# EasyEDA schematic LcsNodes-Building-Block-Dual-Power-Module-L6205.json
TITLE: Dual Power Module - L6205; REV: 1.0; Date: 2022-09-19; Sheet: 1/1; Drawn By: helmut-f; Company: Your Company
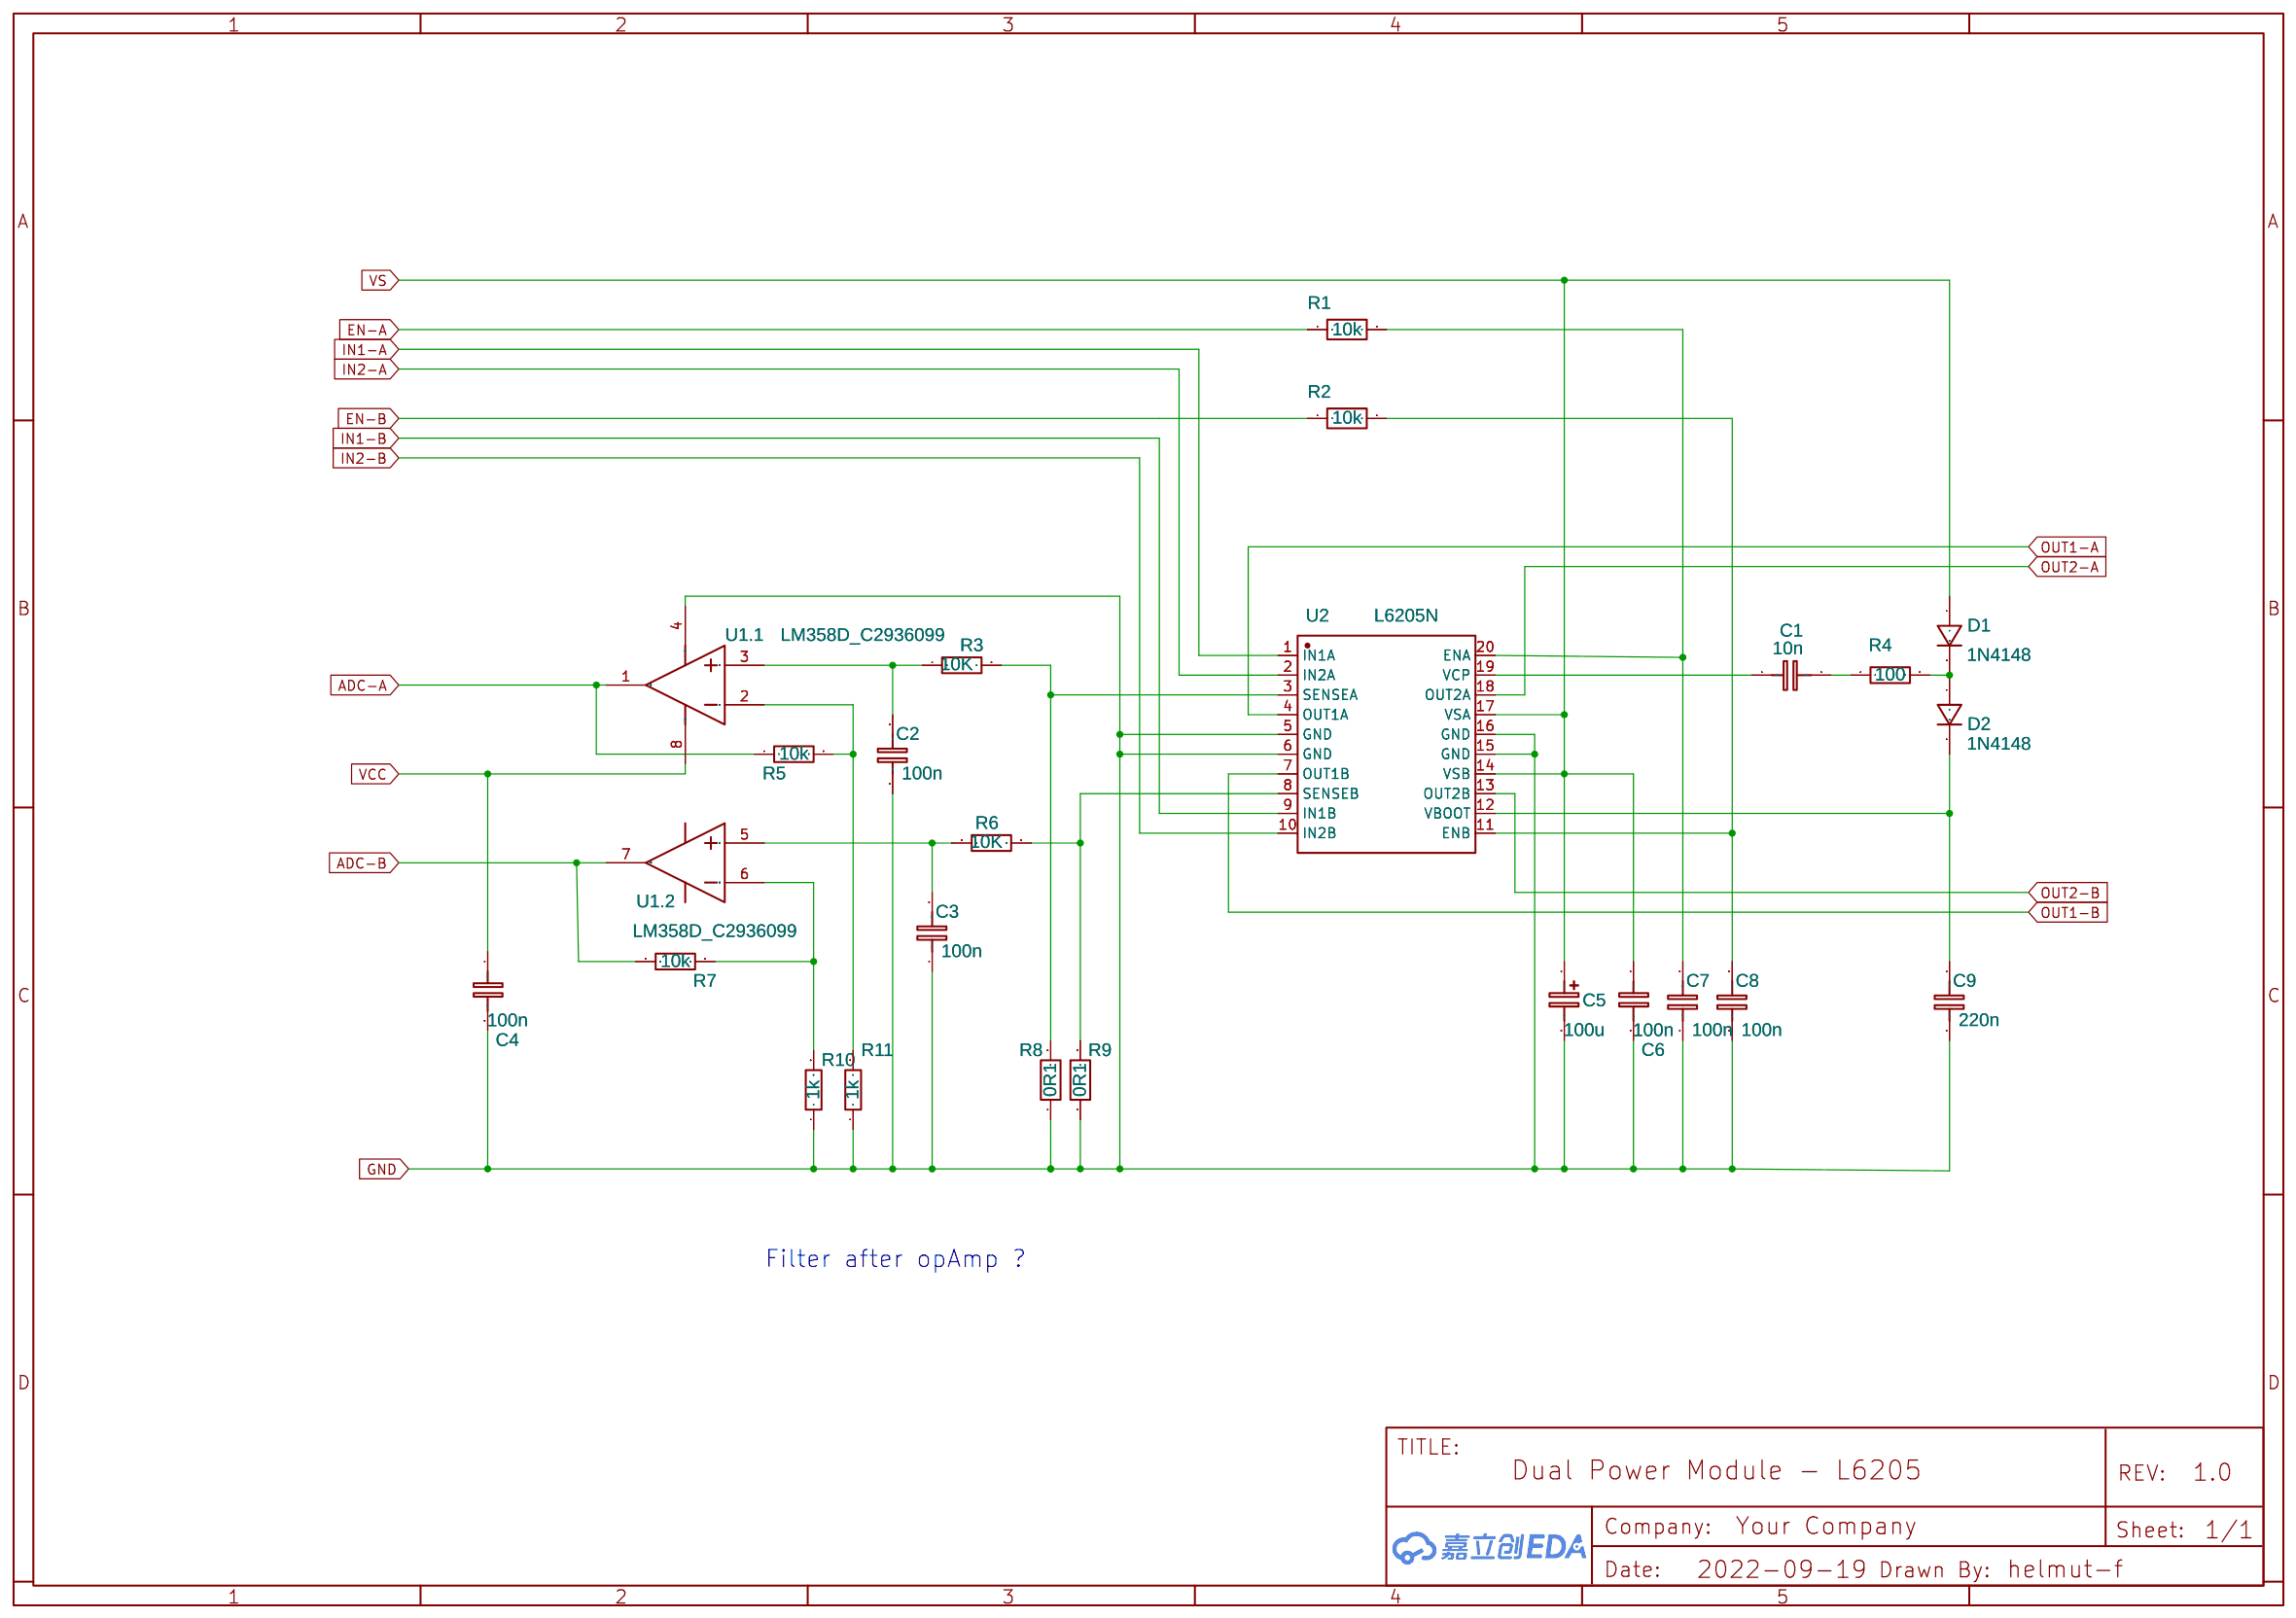
[diagram p0: schematic sheet]

## Parts
C1  10n  [RAD-0.2]
C2  100n  [RAD-0.2]
C3  100n  [RAD-0.2]
C4  100n  [RAD-0.2]
C5  100u  [CAP-D10.0×F5.0]
C6  100n  [RAD-0.2]
C7  100n  [RAD-0.2]
C8  100n  [RAD-0.2]
C9  220n  [RAD-0.2]
D1  1N4148  [DO-35_BD2.0-L4.0-P8.00-D0.5-FD]
D2  1N4148  [DO-35_BD2.0-L4.0-P8.00-D0.5-FD]
R1  10k  [R_AXIAL-0.3]
R2  10k  [R_AXIAL-0.3]
R3  10K  [AXIAL-0.1]
R4  100  [AXIAL-0.1]
R5  10k  [AXIAL-0.1]
R6  10K  [AXIAL-0.1]
R7  10k  [AXIAL-0.1]
R8  0R1  [R_AXIAL-0.5]
R9  0R1  [R_AXIAL-0.5]
R10  1k  [AXIAL-0.1]
R11  1k  [AXIAL-0.1]
U1  LM358D_C2936099  [SO-8_L4.9-W3.9-P1.27-LS5.9-BL]  (sections 1,2)
U2  L6205N  [PDIP-20_L24.5-W7.3-P2.54-LS7.9-BL]

## Library data of the parts
C1-C3 C7-C9 = C_0603_EU: Contributor: LCEDA_Lib
C4 C6 = C_0603_EU: Contributor: LCEDA_Lib; Package Display: No
C5 = CE_TH_D10.0×F5.0_EU: Contributor: LCEDA_Lib
D1 D2 = 1N4148: Supplier: LCSC; Manufacturer: SEMTECH; Supplier Part: C14516; Contributor: LCEDA_Lib
R1 R2 = R_AXIAL-0.3_EU: Contributor: LCEDA_Lib
R3-R7 R10 R11 = RESISTOR-AXIAL-0.1
R8 R9 = R_AXIAL-0.5_EU: Contributor: LCEDA_Lib
U1 = LM358D_C2936099: Supplier: LCSC; Supplier Part: C2936099; Manufacturer: ST(意法半导体); Manufacturer Part: LM358D; link: https://atta.szlcsc.com//upload/public/pdf/source/20220211/86857E2EABC1585834966B2A2DDBE729.pdf; subpart_no: 1
U2 = L6205N: Supplier: LCSC; Supplier Part: C962260; Manufacturer: STMicroelectronics; Contributor: LCSC

## Nets
GND: C2.1 C3.1 C4.2 C5.2 C6.2 C7.1 C8.1 C9.1 R8.1 R9.1 R10.1 R11.1 U1.4(VCC-) U2.5(GND) U2.6(GND) U2.15(GND) U2.16(GND)
VCC: C4.1 U1.8(VCC+)
ADC-A: R5.1 U1.1(OUT1)
ADC-B: R7.1 U1.7(OUT2)
EN-A: R1.1
EN-B: R2.1
IN1-A: U2.1(IN1A)
IN1-B: U2.9(IN1B)
IN2-A: U2.2(IN2A)
IN2-B: U2.10(IN2B)
OUT1-A: U2.4(OUT1A)
OUT1-B: U2.7(OUT1B)
OUT2-A: U2.18(OUT2A)
OUT2-B: U2.13(OUT2B)
VS: C5.1 C6.1 D1.1 U2.14(VSB) U2.17(VSA)
Net-(C1-1): C1.1 U2.19(VCP)
Net-(C1-2): C1.2 R4.1
Net-(C2-2): C2.2 R3.1 U1.3(IN1+)
Net-(C3-2): C3.2 R6.1 U1.5(IN2+)
Net-(C7-2): C7.2 R1.2 U2.20(ENA)
Net-(C8-2): C8.2 R2.2 U2.11(ENB)
Net-(C9-2): C9.2 D2.2 U2.12(VBOOT)
Net-(D1-2): D1.2 D2.1 R4.2
Net-(R3-2): R3.2 R8.2 U2.3(SENSEA)
Net-(R5-2): R5.2 R11.2 U1.2(IN1-)
Net-(R6-2): R6.2 R9.2 U2.8(SENSEB)
Net-(R7-2): R7.2 R10.2 U1.6(IN2-)

## Notes on the sheet
- Filter after opAmp ?
